# Altium schematic sheet Power.SchDoc
size A
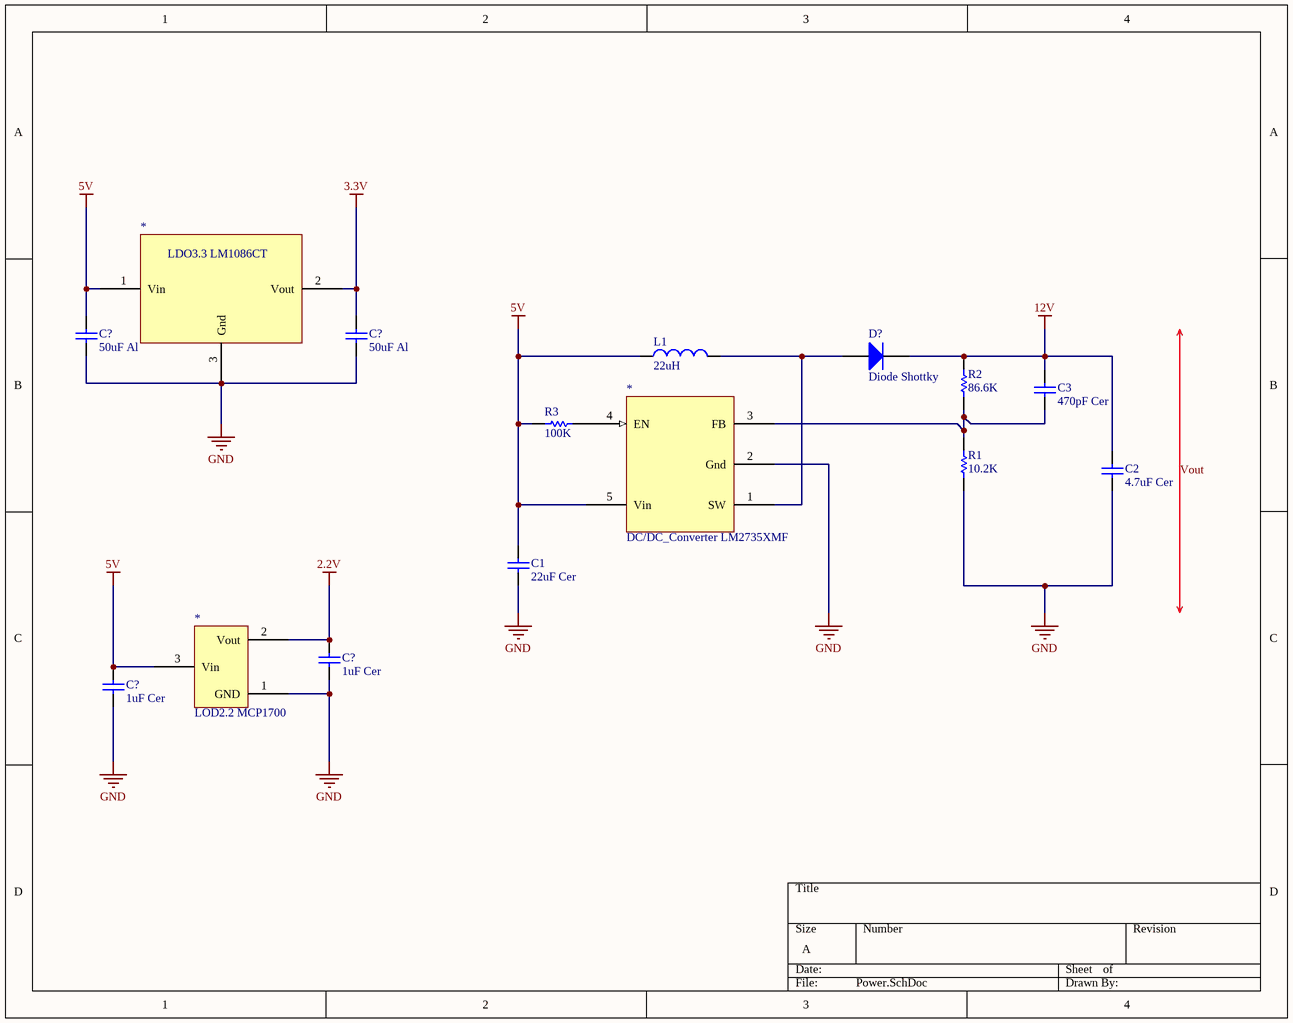
[diagram p0: Power.SchDoc]

## Parts
(Parts that share a designator on the sheet are numbered #1, #2 ... from top to bottom, then left to right.)
*#1  LDO3.3 LM1086CT
*#2  DC/DC_Converter LM2735XMF
*#3  LOD2.2 MCP1700
C1  22uF Cer  [RAD-0.3]
C2  4.7uF Cer  [RAD-0.3]
C3  470pF Cer  [RAD-0.3]
C?#1  50uF Al  [RAD-0.3]
C?#2  50uF Al  [RAD-0.3]
C?#3  1uF Cer  [RAD-0.3]
C?#4  1uF Cer  [RAD-0.3]
D?  Diode Shottky  [SMC]
L1  22uH  [0402-A]
R1  10.2K  [AXIAL-0.3]
R2  86.6K  [AXIAL-0.3]
R3  100K  [AXIAL-0.3]

## Nets
2.2V: *#3.2(Vout) C?#3.2
3.3V: *#1.2(Vout) C?#2.2
5V: *#1.1(Vin) *#2.5(Vin) *#3.3(Vin) C1.2 C?#1.2 C?#4.2 L1.1 R3.1
12V: C2.2 C3.2 D?.2(K) R2.2
GND: *#1.3(Gnd) *#2.2(Gnd) *#3.1(GND) C1.1 C2.1 C?#1.1 C?#2.1 C?#3.1 C?#4.1 R1.1
Net*#2_1: *#2.1(SW) D?.1(A) L1.2
Net*#2_3: *#2.3(FB) C3.1 R1.2 R2.1
Net*#2_4: *#2.4(EN) R3.2

## Notes on the sheet
- Vout

## Library data of the parts
C1 = Cap: Capacitor; Published: 8-Jun-2000; LatestRevisionDate: 17-Jul-2002; LatestRevisionNote: Re-released for DXP Platform.; PackageReference: RAD-0.3; Publisher: Altium Limited; PackageDescription: Radial Cap, Thru-Hole; 2 Leads; 0.3 in Pin Spacing; Value: 22uF
C2 C?#1 C?#2 = Cap: Capacitor; Value: 10uF; Published: 8-Jun-2000; LatestRevisionDate: 17-Jul-2002; LatestRevisionNote: Re-released for DXP Platform.; PackageReference: RAD-0.3; Publisher: Altium Limited; PackageDescription: Radial Cap, Thru-Hole; 2 Leads; 0.3 in Pin Spacing
C3 = Cap: Capacitor; Value: 330pF; Published: 8-Jun-2000; LatestRevisionDate: 17-Jul-2002; LatestRevisionNote: Re-released for DXP Platform.; PackageReference: RAD-0.3; Publisher: Altium Limited; PackageDescription: Radial Cap, Thru-Hole; 2 Leads; 0.3 in Pin Spacing
C?#3 C?#4 = Cap: Capacitor; Value: 22uF; Published: 8-Jun-2000; LatestRevisionDate: 17-Jul-2002; LatestRevisionNote: Re-released for DXP Platform.; PackageReference: RAD-0.3; Publisher: Altium Limited; PackageDescription: Radial Cap, Thru-Hole; 2 Leads; 0.3 in Pin Spacing
D? = Diode: Default Diode; Published: 8-Jun-2000; LatestRevisionDate: 17-Jul-2002; LatestRevisionNote: Re-released for DXP Platform.; PackageVersion: Sep-1996; PackageReference: SMC; Publisher: Altium Limited; PackageDescription: DO-214-AB/SMC; 2 C-Bend Leads; Body 7.9 x 5.9 mm, inc. leads (LxW); Code_JEDEC: DO-214-AB
L1 = Inductor: Code_IEC: 1005; Value: 33uH; Published: 8-Jun-2000; LatestRevisionDate: 29-May-2009; LatestRevisionNote: IPC-7351 Footprint Added.; PackageReference: 0402-A; Publisher: Altium Limited; PackageDescription: Chip Inductor; Code_JEITA: 0402
R1-R3 = Res1: Resistor; Published: 8-Jun-2000; LatestRevisionDate: 17-Jul-2002; LatestRevisionNote: Re-released for DXP Platform.; PackageReference: AXIAL-0.3; Publisher: Altium Limited; PackageDescription: Axial Device, Thru-Hole; 2 Leads; 0.3 in Pin Spacing
  R1: Value: 10.2K
  R2: Value: 86.6K
  R3: Value: 100K